# Altium schematic sheet WL_STRUKTURKA.SchDoc
size A3; SheetNumber: 1; SheetTotal: 9
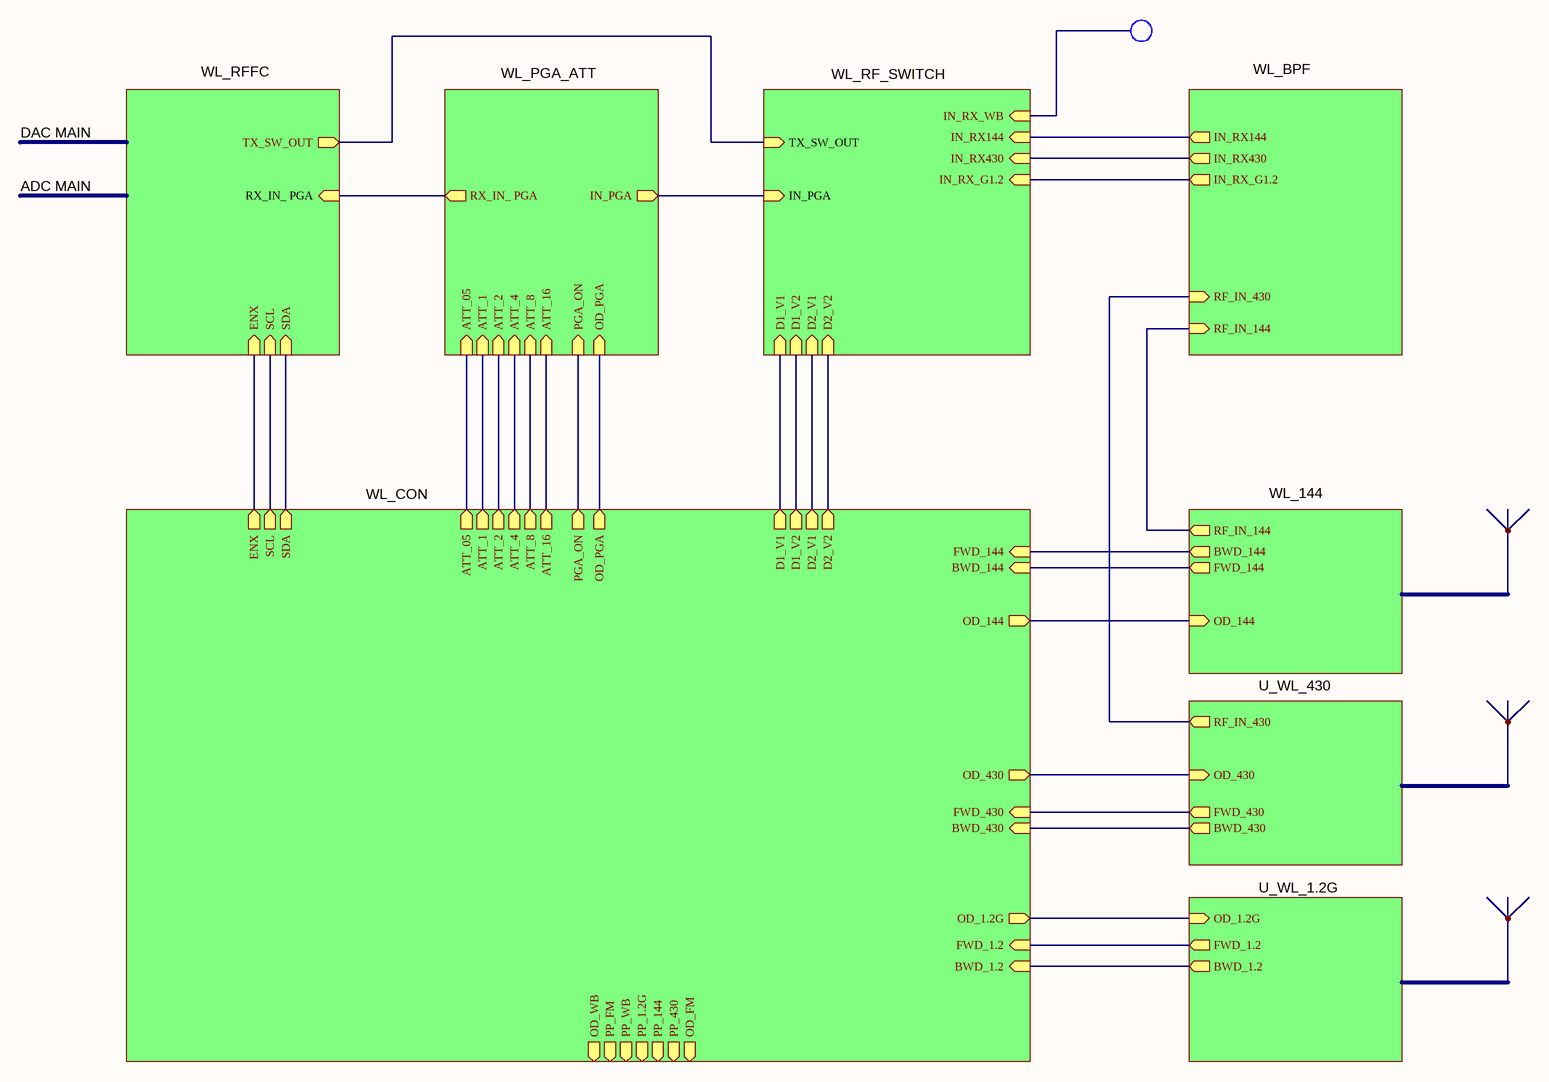
[diagram p0: WL_STRUKTURKA.SchDoc]

## Sub-sheets
U_WL_1.2G = WL_1.2G.SchDoc: OD_1.2G (in), FWD_1.2 (out), BWD_1.2 (out)
U_WL_430 = WL_430.SchDoc: FWD_430 (out), BWD_430 (out), OD_430 (in), RF_IN_430 (out)
WL_144 = WL_144.SchDoc: FWD_144 (out), BWD_144 (out), OD_144 (in), RF_IN_144 (out)
WL_BPF = WL_BPF.SchDoc: RF_IN_144 (in), RF_IN_430 (in), IN_RX144 (out), IN_RX430 (out), IN_RX_G1.2 (out)
WL_CON = WL_CON.SchDoc: D1_V1 (out), D1_V2 (out), D2_V1 (out), D2_V2 (out), SDA (out), SCL (out), ENX (out), ATT_05 (out), ATT_1 (out), ATT_2 (out), ATT_4 (out), ATT_8 (out), ATT_16 (out), FWD_144 (in), BWD_144 (in), OD_144 (out), OD_430 (out), FWD_430 (in), BWD_430 (in), OD_1.2G (out), FWD_1.2 (in), BWD_1.2 (in), OD_FM (out), PGA_ON (out), PP_430 (out), PP_144 (out), PP_1.2G (out), PP_WB (out), PP_FM (out), OD_WB (out), OD_PGA (out)
WL_PGA_ATT = WL_PGA_ATT.SchDoc: IN_PGA (out), RX_IN_ PGA (out), ATT_05 (in), ATT_1 (in), ATT_2 (in), ATT_4 (in), ATT_8 (in), ATT_16 (in), PGA_ON (in), OD_PGA (in)
WL_RF_SWITCH = WL_RF_SWITCH.SchDoc: IN_PGA (in), TX_SW_OUT (in), IN_RX_WB (in), D1_V1 (in), D1_V2 (in), D2_V1 (in), D2_V2 (in), IN_RX144 (in), IN_RX430 (in), IN_RX_G1.2 (in)
WL_RFFC = WL_RFFC.SchDoc: RX_IN_ PGA (in), TX_SW_OUT (out), SDA (in), SCL (in), ENX (in)

## Nets
(unnamed): sheet WL_144/FWD_144, sheet WL_CON/BWD_144
(unnamed): sheet WL_144/BWD_144, sheet WL_CON/FWD_144
(unnamed): sheet WL_144/OD_144, sheet WL_CON/OD_144
(unnamed): sheet WL_144/RF_IN_144, sheet WL_BPF/RF_IN_144
(unnamed): sheet WL_CON/D1_V1, sheet WL_RF_SWITCH/D1_V1
(unnamed): sheet WL_CON/D1_V2, sheet WL_RF_SWITCH/D1_V2
(unnamed): sheet WL_CON/D2_V1, sheet WL_RF_SWITCH/D2_V1
(unnamed): sheet WL_CON/D2_V2, sheet WL_RF_SWITCH/D2_V2
(unnamed): sheet WL_CON/SDA, sheet WL_RFFC/SDA
(unnamed): sheet WL_CON/SCL, sheet WL_RFFC/SCL
(unnamed): sheet WL_CON/ENX, sheet WL_RFFC/ENX
(unnamed): sheet WL_CON/ATT_05, sheet WL_PGA_ATT/ATT_05
(unnamed): sheet WL_CON/ATT_1, sheet WL_PGA_ATT/ATT_1
(unnamed): sheet WL_CON/ATT_2, sheet WL_PGA_ATT/ATT_2
(unnamed): sheet WL_CON/ATT_4, sheet WL_PGA_ATT/ATT_4
(unnamed): sheet WL_CON/ATT_8, sheet WL_PGA_ATT/ATT_8
(unnamed): sheet WL_CON/ATT_16, sheet WL_PGA_ATT/ATT_16
(unnamed): sheet WL_CON/OD_430, sheet U_WL_430/OD_430
(unnamed): sheet WL_CON/FWD_430, sheet U_WL_430/FWD_430
(unnamed): sheet WL_CON/BWD_430, sheet U_WL_430/BWD_430
(unnamed): sheet WL_CON/OD_1.2G, sheet U_WL_1.2G/OD_1.2G
(unnamed): sheet WL_CON/FWD_1.2, sheet U_WL_1.2G/FWD_1.2
(unnamed): sheet WL_CON/BWD_1.2, sheet U_WL_1.2G/BWD_1.2
(unnamed): sheet WL_CON/PGA_ON, sheet WL_PGA_ATT/PGA_ON
(unnamed): sheet WL_CON/OD_PGA, sheet WL_PGA_ATT/OD_PGA
(unnamed): sheet WL_PGA_ATT/IN_PGA, sheet WL_RF_SWITCH/IN_PGA
(unnamed): sheet WL_PGA_ATT/RX_IN_ PGA, sheet WL_RFFC/RX_IN_ PGA
(unnamed): sheet WL_RF_SWITCH/TX_SW_OUT, sheet WL_RFFC/TX_SW_OUT
(unnamed): sheet WL_RF_SWITCH/IN_RX144, sheet WL_BPF/IN_RX144
(unnamed): sheet WL_RF_SWITCH/IN_RX430, sheet WL_BPF/IN_RX430
(unnamed): sheet WL_RF_SWITCH/IN_RX_G1.2, sheet WL_BPF/IN_RX_G1.2
(unnamed): sheet WL_BPF/RF_IN_430, sheet U_WL_430/RF_IN_430

## Notes on the sheet
- DAC MAIN
- ADC MAIN